# Altium schematic sheet UFL.SchDoc: UFL
size 420 x 297 mm
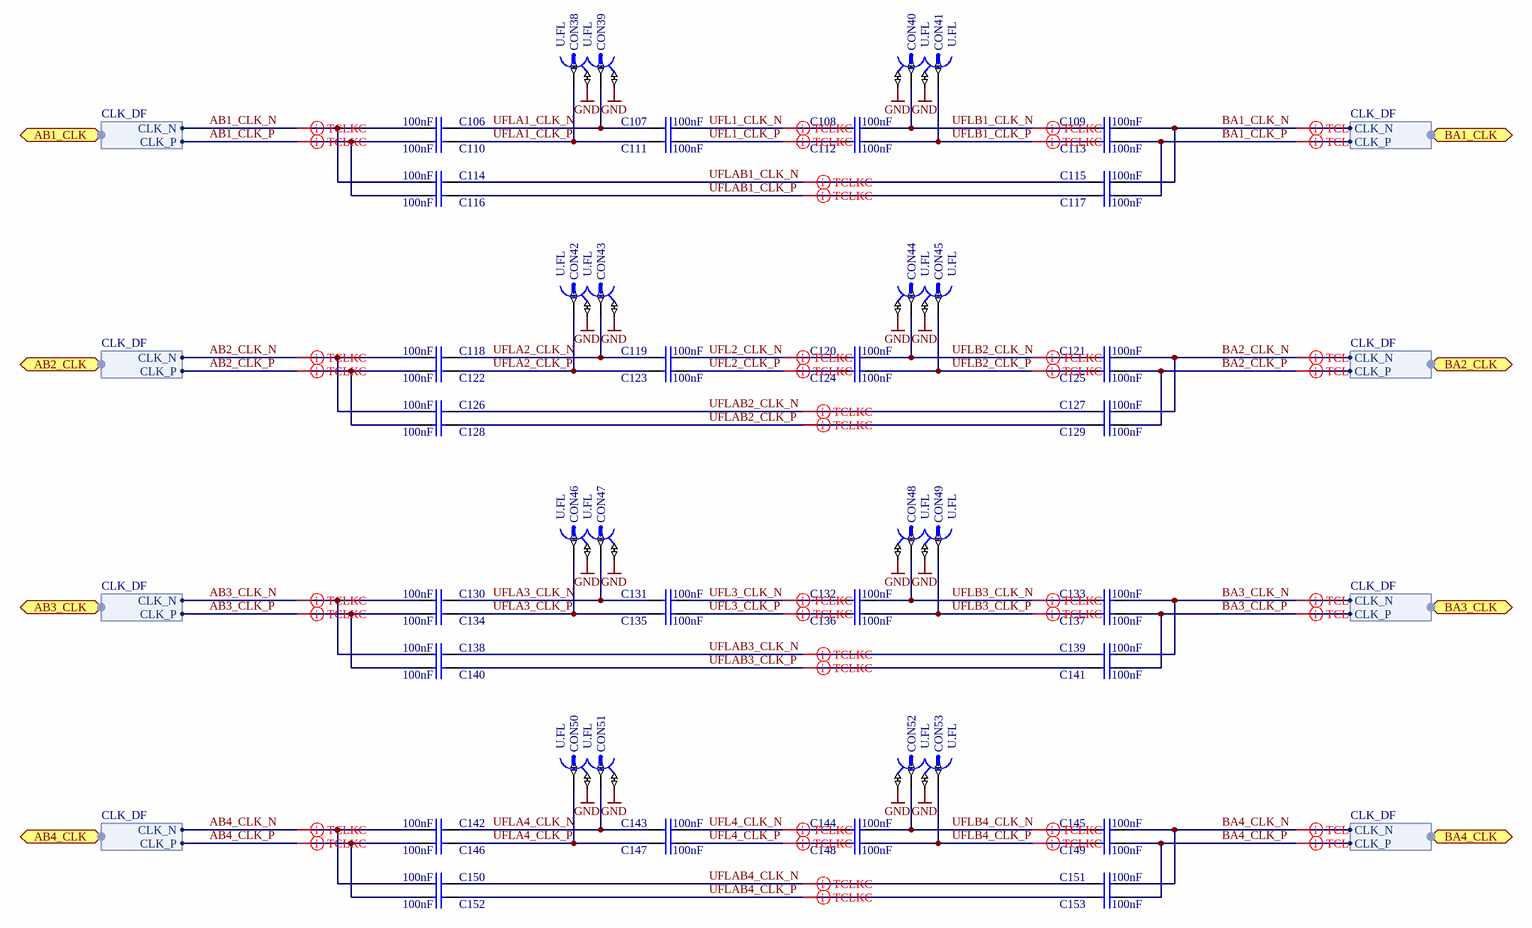
[diagram p0: UFL.SchDoc]

## Parts
C106  100nF  [CAPC0603X33N]
C107  100nF  [CAPC0603X33N]
C108  100nF  [CAPC0603X33N]
C109  100nF  [CAPC0603X33N]
C110  100nF  [CAPC0603X33N]
C111  100nF  [CAPC0603X33N]
C112  100nF  [CAPC0603X33N]
C113  100nF  [CAPC0603X33N]
C114  100nF  [CAPC0603X33N]
C115  100nF  [CAPC0603X33N]
C116  100nF  [CAPC0603X33N]
C117  100nF  [CAPC0603X33N]
C118  100nF  [CAPC0603X33N]
C119  100nF  [CAPC0603X33N]
C120  100nF  [CAPC0603X33N]
C121  100nF  [CAPC0603X33N]
C122  100nF  [CAPC0603X33N]
C123  100nF  [CAPC0603X33N]
C124  100nF  [CAPC0603X33N]
C125  100nF  [CAPC0603X33N]
C126  100nF  [CAPC0603X33N]
C127  100nF  [CAPC0603X33N]
C128  100nF  [CAPC0603X33N]
C129  100nF  [CAPC0603X33N]
C130  100nF  [CAPC0603X33N]
C131  100nF  [CAPC0603X33N]
C132  100nF  [CAPC0603X33N]
C133  100nF  [CAPC0603X33N]
C134  100nF  [CAPC0603X33N]
C135  100nF  [CAPC0603X33N]
C136  100nF  [CAPC0603X33N]
C137  100nF  [CAPC0603X33N]
C138  100nF  [CAPC0603X33N]
C139  100nF  [CAPC0603X33N]
C140  100nF  [CAPC0603X33N]
C141  100nF  [CAPC0603X33N]
C142  100nF  [CAPC0603X33N]
C143  100nF  [CAPC0603X33N]
C144  100nF  [CAPC0603X33N]
C145  100nF  [CAPC0603X33N]
C146  100nF  [CAPC0603X33N]
C147  100nF  [CAPC0603X33N]
C148  100nF  [CAPC0603X33N]
C149  100nF  [CAPC0603X33N]
C150  100nF  [CAPC0603X33N]
C151  100nF  [CAPC0603X33N]
C152  100nF  [CAPC0603X33N]
C153  100nF  [CAPC0603X33N]
CON38  U.FL  [HIROSE_U.FL-R-SMT-1(10)]
CON39  U.FL  [HIROSE_U.FL-R-SMT-1(10)]
CON40  U.FL  [HIROSE_U.FL-R-SMT-1(10)]
CON41  U.FL  [HIROSE_U.FL-R-SMT-1(10)]
CON42  U.FL  [HIROSE_U.FL-R-SMT-1(10)]
CON43  U.FL  [HIROSE_U.FL-R-SMT-1(10)]
CON44  U.FL  [HIROSE_U.FL-R-SMT-1(10)]
CON45  U.FL  [HIROSE_U.FL-R-SMT-1(10)]
CON46  U.FL  [HIROSE_U.FL-R-SMT-1(10)]
CON47  U.FL  [HIROSE_U.FL-R-SMT-1(10)]
CON48  U.FL  [HIROSE_U.FL-R-SMT-1(10)]
CON49  U.FL  [HIROSE_U.FL-R-SMT-1(10)]
CON50  U.FL  [HIROSE_U.FL-R-SMT-1(10)]
CON51  U.FL  [HIROSE_U.FL-R-SMT-1(10)]
CON52  U.FL  [HIROSE_U.FL-R-SMT-1(10)]
CON53  U.FL  [HIROSE_U.FL-R-SMT-1(10)]

## Ports
AB1_CLK (harness CLK_DF), AB2_CLK (harness CLK_DF), AB3_CLK (harness CLK_DF), AB4_CLK (harness CLK_DF), BA1_CLK (harness CLK_DF), BA2_CLK (harness CLK_DF), BA3_CLK (harness CLK_DF), BA4_CLK (harness CLK_DF)

## Harnesses
CLK_DF: CLK_P, CLK_N

## Nets
GND: CON38.2 CON39.2 CON40.2 CON41.2 CON42.2 CON43.2 CON44.2 CON45.2 CON46.2 CON47.2 CON48.2 CON49.2 CON50.2 CON51.2 CON52.2 CON53.2
AB1_CLK_N: C106.1 C114.1 ; port AB1_CLK.CLK_N
AB1_CLK_P: C110.1 C116.1 ; port AB1_CLK.CLK_P
AB2_CLK_N: C118.1 C126.1 ; port AB2_CLK.CLK_N
AB2_CLK_P: C122.1 C128.1 ; port AB2_CLK.CLK_P
AB3_CLK_N: C130.1 C138.1 ; port AB3_CLK.CLK_N
AB3_CLK_P: C134.1 C140.1 ; port AB3_CLK.CLK_P
AB4_CLK_N: C142.1 C150.1 ; port AB4_CLK.CLK_N
AB4_CLK_P: C146.1 C152.1 ; port AB4_CLK.CLK_P
BA1_CLK_N: C109.1 C115.1 ; port BA1_CLK.CLK_N
BA1_CLK_P: C113.1 C117.1 ; port BA1_CLK.CLK_P
BA2_CLK_N: C121.1 C127.1 ; port BA2_CLK.CLK_N
BA2_CLK_P: C125.1 C129.1 ; port BA2_CLK.CLK_P
BA3_CLK_N: C133.1 C139.1 ; port BA3_CLK.CLK_N
BA3_CLK_P: C137.1 C141.1 ; port BA3_CLK.CLK_P
BA4_CLK_N: C145.1 C151.1 ; port BA4_CLK.CLK_N
BA4_CLK_P: C149.1 C153.1 ; port BA4_CLK.CLK_P
UFL1_CLK_N: C107.1 C108.2
UFL1_CLK_P: C111.1 C112.2
UFL2_CLK_N: C119.1 C120.2
UFL2_CLK_P: C123.1 C124.2
UFL3_CLK_N: C131.1 C132.2
UFL3_CLK_P: C135.1 C136.2
UFL4_CLK_N: C143.1 C144.2
UFL4_CLK_P: C147.1 C148.2
UFLA1_CLK_N: C106.2 C107.2 CON39.1
UFLA1_CLK_P: C110.2 C111.2 CON38.1
UFLA2_CLK_N: C118.2 C119.2 CON43.1
UFLA2_CLK_P: C122.2 C123.2 CON42.1
UFLA3_CLK_N: C130.2 C131.2 CON47.1
UFLA3_CLK_P: C134.2 C135.2 CON46.1
UFLA4_CLK_N: C142.2 C143.2 CON51.1
UFLA4_CLK_P: C146.2 C147.2 CON50.1
UFLAB1_CLK_N: C114.2 C115.2
UFLAB1_CLK_P: C116.2 C117.2
UFLAB2_CLK_N: C126.2 C127.2
UFLAB2_CLK_P: C128.2 C129.2
UFLAB3_CLK_N: C138.2 C139.2
UFLAB3_CLK_P: C140.2 C141.2
UFLAB4_CLK_N: C150.2 C151.2
UFLAB4_CLK_P: C152.2 C153.2
UFLB1_CLK_N: C108.1 C109.2 CON40.1
UFLB1_CLK_P: C112.1 C113.2 CON41.1
UFLB2_CLK_N: C120.1 C121.2 CON44.1
UFLB2_CLK_P: C124.1 C125.2 CON45.1
UFLB3_CLK_N: C132.1 C133.2 CON48.1
UFLB3_CLK_P: C136.1 C137.2 CON49.1
UFLB4_CLK_N: C144.1 C145.2 CON52.1
UFLB4_CLK_P: C148.1 C149.2 CON53.1

## Layout directives
differential pair: AB1_CLK_N, AB1_CLK_P, AB2_CLK_N, AB2_CLK_P, AB3_CLK_N, AB3_CLK_P, AB4_CLK_N, AB4_CLK_P, BA1_CLK_N, BA1_CLK_P, BA2_CLK_N, BA2_CLK_P, BA3_CLK_N, BA3_CLK_P, BA4_CLK_N, BA4_CLK_P, UFL1_CLK_N, UFL1_CLK_P, UFL2_CLK_N, UFL2_CLK_P, UFL3_CLK_N, UFL3_CLK_P, UFL4_CLK_N, UFL4_CLK_P, UFLAB1_CLK_N, UFLAB1_CLK_P, UFLAB2_CLK_N, UFLAB2_CLK_P, UFLAB3_CLK_N, UFLAB3_CLK_P, UFLAB4_CLK_N, UFLAB4_CLK_P, UFLB1_CLK_N, UFLB1_CLK_P, UFLB2_CLK_N, UFLB2_CLK_P, UFLB3_CLK_N, UFLB3_CLK_P, UFLB4_CLK_N, UFLB4_CLK_P

## Notes on the sheet
- Project/Equipment
- Document
- uTCA RTM 8 SFP+
- Designer
- Drawn by
- Check.by
- Copyright Creotech Instruments SA 2014.
  This documentation describes Open Hardware and is licensed under the CERN OHL v.1.1. You may redistribute and modify this documentation under the terms of the CERN OHL v.1.1. (http://ohwr.org/CERNOHL). This documentation is distributed WITHOUT ANY EXPRESS OR IMPLIED WARRANTY, INCLUDING OF MERCHANTABILITY, SATISFACTORY QUALITY AND FITNESS FOR A PARTICULAR PURPOSE. Please see the CERN OHL v.1.1 for applicable conditions.
- Creotech Instruments S.A.
- File
- Last Mod.
- Print Date
- Sheet
- Size
- A3
- of
- Rev

## Library data of the parts
C106-C153 = CC0201_100NF_6.3V_10%_X5R: Non-polarised capacitor; Part Description: SMD Multilayer Chip Ceramic Capacitor; Manufacturer: GENERIC; Manufacturer1 Part Number: 02016D104KAT2A; Voltage: 6.3V; TC: X5R; Tolerance: ±10%; Table: Capacitors SMD; Part Number: CC0201_100NF_6.3V_10%_X5R; Component Kind: Standard; Component Type: Standard; Pin Count: 2; Value: 100nF; Status: Not Recommended; Manufacturer Part Number: CC0201_100NF_6.3V_10%_X5R; Case: 0201; Mounted: Yes; Socket: No; SMD: Yes; Manufacturer1 Example: AVX; Manufacturer1 ComponentHeight: 0.33mm; HelpURL: \\cern.ch\dfs\Applications\Altium\Datasheets\CC0201_X5R_AVX.pdf; Author: CERN DEM JLC; CreateDate: 2007-12-03; LatestRevisionDate: 2007-12-03
CON38-CON53 = HIROSE_U.FL-R-SMT-1(10): Part Description: Up to 6GHz Ultra Small Surface Mount Male Coaxial Connectors U.FL Series; Manufacturer: HIROSE (HRS); Table: Miscellaneous; Part Number: HIROSE_U.FL-R-SMT-1(10); Component Kind: Standard; Component Type: Standard; Pin Count: 2; Family: U.FL; Mounted: Yes; Socket: No; SMD: Yes; Status: None; Manufacturer Part Number: U.FL-R-SMT-1(10); ComponentHeight: 1.25mm; HelpURL: \\cern.ch\dfs\Applications\Altium\Datasheets\HIROSE_U.FL-R-SMT-1(10).pdf; Author: CERN DEM JLC; CreateDate: 2010-03-24; LatestRevisionDate: 2010-03-24